# Altium schematic sheet tusb3410.SchDoc
size A3
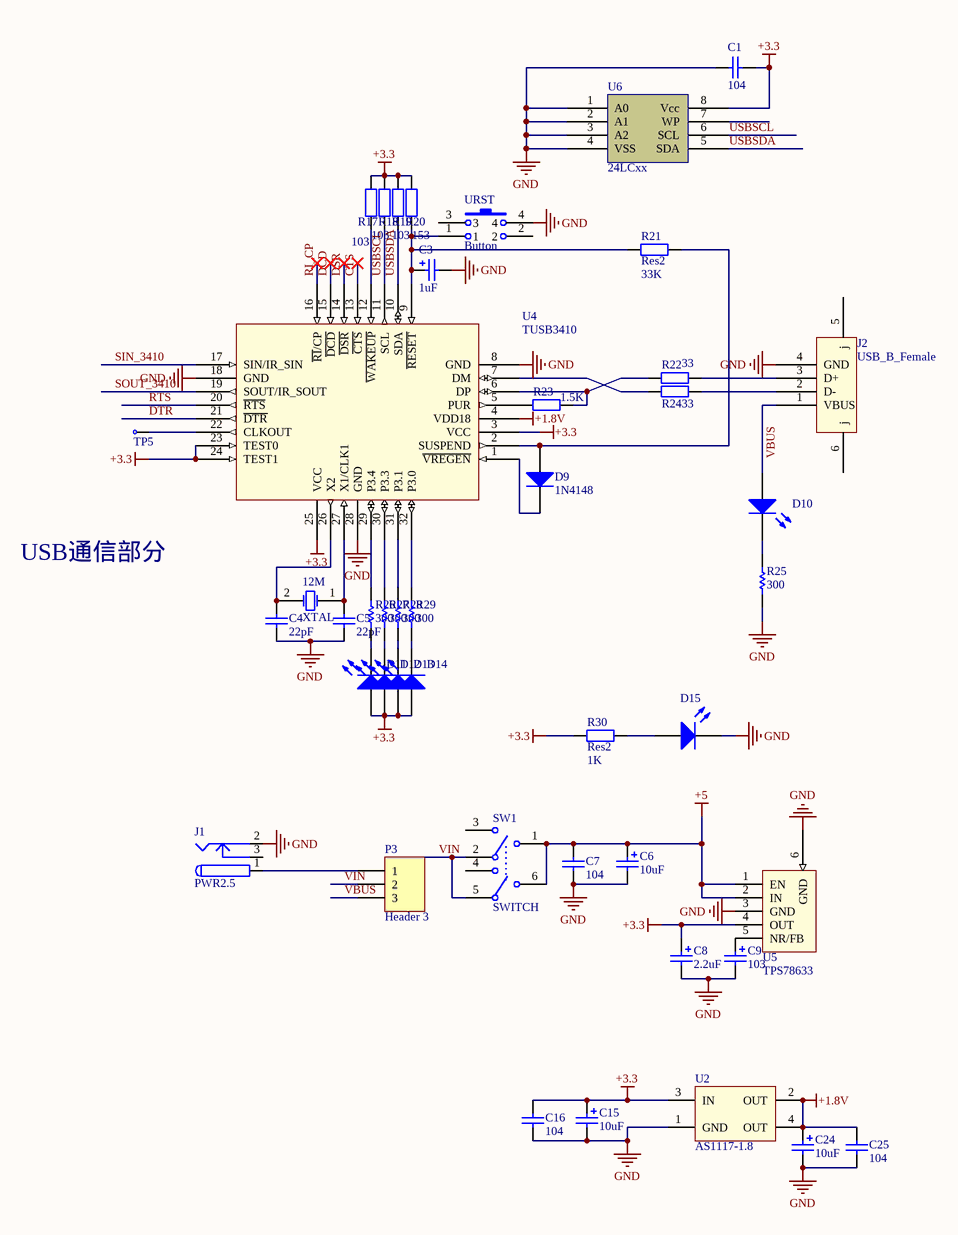
[diagram p0: tusb3410.SchDoc]

## Parts
12M  XTAL  [GJA-M]
C1  value 104  [C0805]  (hidden comment: Cap)
C3  value 1uF  [C5.3]  (hidden comment: Cap Pol1)
C4  value 22pF  [C0805]  (hidden comment: Cap)
C5  value 22pF  [C0805]  (hidden comment: Cap)
C6  value 10uF  [C5.3]  (hidden comment: Cap Pol1)
C7  value 104  [C0805]  (hidden comment: Cap)
C8  value 2.2uF  [C5.3]  (hidden comment: Cap Pol1)
C9  value 103  [C5.3]  (hidden comment: Cap Pol1)
C15  value 10uF  [C5.3]  (hidden comment: Cap Pol1)
C16  value 104  [C0805]  (hidden comment: Cap)
C24  value 10uF  [C5.3]  (hidden comment: Cap Pol1)
C25  value 104  [C0805]  (hidden comment: Cap)
D9  1N4148  [DO-35]
D10  LED1  [LED]  (value not drawn)
D11  LED1  [C0805]  (value not drawn)
D12  LED1  [C0805]  (value not drawn)
D13  LED1  [C0805]  (value not drawn)
D14  LED1  [C0805]  (value not drawn)
D15  LED1  [LED]  (value not drawn)
J1  PWR2.5  [DCJACK]
J2  USB_B_Female  [USB_B_Female]
P3  Header 3  [HDR1X3]
R17  value 103  [c0805]  (hidden comment: Res2)
R18  value 103  [c0805]  (hidden comment: Res2)
R19  value 103  [c0805]  (hidden comment: Res2)
R20  value 153  [c0805]  (hidden comment: Res2)
R21  Res2  value 33K  [c0805]
R22  value 33  [c0805]  (hidden comment: Res2)
R23  value 1.5K  [c0805]  (hidden comment: Res2)
R24  value 33  [c0805]  (hidden comment: Res2)
R25  value 300  [C0805]  (hidden comment: Res1)
R26  value 300  [C0805]  (hidden comment: Res1)
R27  value 300  [C0805]  (hidden comment: Res1)
R28  value 300  [C0805]  (hidden comment: Res1)
R29  value 300  [C0805]  (hidden comment: Res1)
R30  Res2  value 1K  [c0805]
SW1  SWITCH  [DPDT-6]
TP5  TestPoint  [TESTPOINT]  (value not drawn)
U2  AS1117-1.8  [SOT-223]
U4  TUSB3410  [DMC68HC908JL8]
U5  TPS78633  [PSFM_G5]
U6  24LCxx  [DIP-8]
URST  Button  [SW-6]

## Nets
+1.8V: C24.1 C25.2 U2.2(OUT) U2.4(OUT) U4.4(VDD18)
+3.3: C1.2 C8.1 C15.1 C16.2 D11.1(A) D12.1(A) D13.1(A) D14.1(A) R17.2 R18.2 R19.2 R20.2 R30.1 U2.3(IN) U4.3(VCC) U4.23(TEST0) U4.24(TEST1) U4.25(VCC) U5.4(OUT) U6.8(Vcc)
+5: C6.1 C7.2 SW1.1 SW1.6 U5.1(EN) U5.2(IN)
GND: C1.1 C3.2 C4.2 C5.2 C6.2 C7.1 C8.2 C9.2 C15.2 C16.1 C24.2 C25.1 D15.2(K) J1.2 J2.4(GND) R25.1 U2.1(GND) U4.8(GND) U4.18(GND) U4.28(GND) U5.3(GND) U5.6(GND) U6.1(A0) U6.2(A1) U6.3(A2) U6.4(VSS) URST.4
CTS: U4.13(~{CTS})
DCD: U4.15(~{DCD})
DSR: U4.14(~{DSR})
DTR: U4.21(~{DTR})
RI_CP: U4.16(~{RI}/CP)
RTS: U4.20(~{RTS})
SIN_3410: U4.17(SIN/IR_SIN)
SOUT_3410: U4.19(SOUT/IR_SOUT)
USBSCL: R18.1 U4.11(SCL) U6.6(SCL)
USBSDA: R19.1 U4.10(SDA) U6.5(SDA)
VBUS: D10.1(A) J2.1(VBUS) P3.3
VIN: P3.2 SW1.2 SW1.5
Net12M_1: 12M.1(OSC1) C5.1 U4.27(X1/CLK1)
Net12M_2: 12M.2(OSC2) C4.1 U4.26(X2)
NetC3_1: C3.1 R20.1 R21.1 U4.9(~{RESET}) URST.1
NetC9_1: C9.1 U5.5(NR/FB)
NetD9_1: D9.1(A) R21.2 U4.2(SUSPEND)
NetD9_2: D9.2(K) U4.1(~{VREGEN})
NetD10_2: D10.2(K) R25.2
NetD11_2: D11.2(K) R26.2
NetD12_2: D12.2(K) R27.2
NetD13_2: D13.2(K) R28.2
NetD14_2: D14.2(K) R29.2
NetD15_1: D15.1(A) R30.2
NetJ1_1: J1.1 P3.1
NetJ2_2: J2.2(D-) R24.2
NetJ2_3: J2.3(D+) R22.2
NetR17_1: R17.1 U4.12(~{WAKEUP})
NetR22_1: R22.1 R23.2 U4.6(DP)
NetR23_1: R23.1 U4.5(PUR)
NetR24_1: R24.1 U4.7(DM)
NetR26_1: R26.1 U4.29(P3.4)
NetR27_1: R27.1 U4.30(P3.3)
NetR28_1: R28.1 U4.31(P3.1)
NetR29_1: R29.1 U4.32(P3.0)
NetTP5_1: TP5.1(TP) U4.22(CLKOUT)

Not connected (* = marked no-connect by the designer): J1 3; J2 5(j) 6(j); SW1 3 4; U6 7(WP); URST 2 3

## Notes on the sheet
- USB通信部分

## Library data of the parts
12M = XTAL: Crystal Oscillator; Published: 8-Jun-2000; Revision: July-2002: Re-released for DXP Platform.; Publisher: Altium Limited
C1 C4 C5 C7 C16 C25 = Cap: Capacitor; Published: 8-Jun-2000; Publisher: Altium Limited
  C1 C7 C16 C25: Revision: July-2002: Re-released for DXP Platform.
  C4 C5: LatestRevisionDate: 17-Jul-2002; LatestRevisionNote: Re-released for DXP Platform.; PackageReference: RAD-0.3
C3 C6 C8 C9 C15 C24 = Cap Pol1: Polarized Capacitor (Radial); Published: 8-Jun-2000; Revision: July-2002: Re-released for DXP Platform.; Publisher: Altium Limited
D9 = Diode 1N4148: High Conductance Fast Diode; Published: 8-Jun-2000; LatestRevisionDate: 17-Jul-2002; LatestRevisionNote: Re-released for DXP Platform.; DatasheetDocument: 1997; PackageReference: DO-35; Publisher: Altium Limited; Code_JEDEC: DO-204-AH; ComponentLink1Description: Manufacturer Link; ComponentLink1URL: http://www.fairchildsemi.com/; ComponentLink2Description: Datasheet; ComponentLink2URL: http://www.fairchildsemi.com/ds/1N%2F1N4148.pdf
D10-D15 = LED1: Typical RED GaAs LED; Published: 8-Jun-2000; LatestRevisionDate: 08-Jul-2005; LatestRevisionNote: Mech Layer 1 removed.; PackageReference: LED-1; Publisher: Altium Limited
J1 = PWR2.5: Low Voltage Power Supply Connector; Published: 17-Dec-2003; DatasheetDocument: 09-May-2002; Publisher: Altium Limited; ComponentLink1Description: Manufacturer Link; ComponentLink1URL: http://domino.kycon.com/internet/Products.html
P3 = Header 3: Header, 3-Pin; LatestRevisionDate: 17-Jul-2002; LatestRevisionNote: Re-released for DXP Platform.; Publisher: Altium Limited
R17-R24 R30 = Res2: Resistor; Published: 8-Jun-2000; Revision: July-2002: Re-released for DXP Platform.; Publisher: Altium Limited
R25-R29 = Res1: Resistor; Published: 8-Jun-2000; LatestRevisionDate: 17-Jul-2002; LatestRevisionNote: Re-released for DXP Platform.; PackageReference: AXIAL-0.3; Publisher: Altium Limited
SW1 = SW-DPDT
TP5 = TestPoint: TespPoint
U2 = AS1117-3.3
U5 = TPS78633: 3.3V Power
URST = Button_4